# EasyEDA Pro project 3轴6.1--esp32 -(0604)改.eprj, schematic 原理图
Board Name: esp32; Create Date: 2025-05-14; Page Name: 电源; Project Name: 3轴6.1--esp32; Schematic Name: 原理图; Update Date: 2025-05-30; Company: 嘉立创EDA; Page Size: A3; Version: V1.0
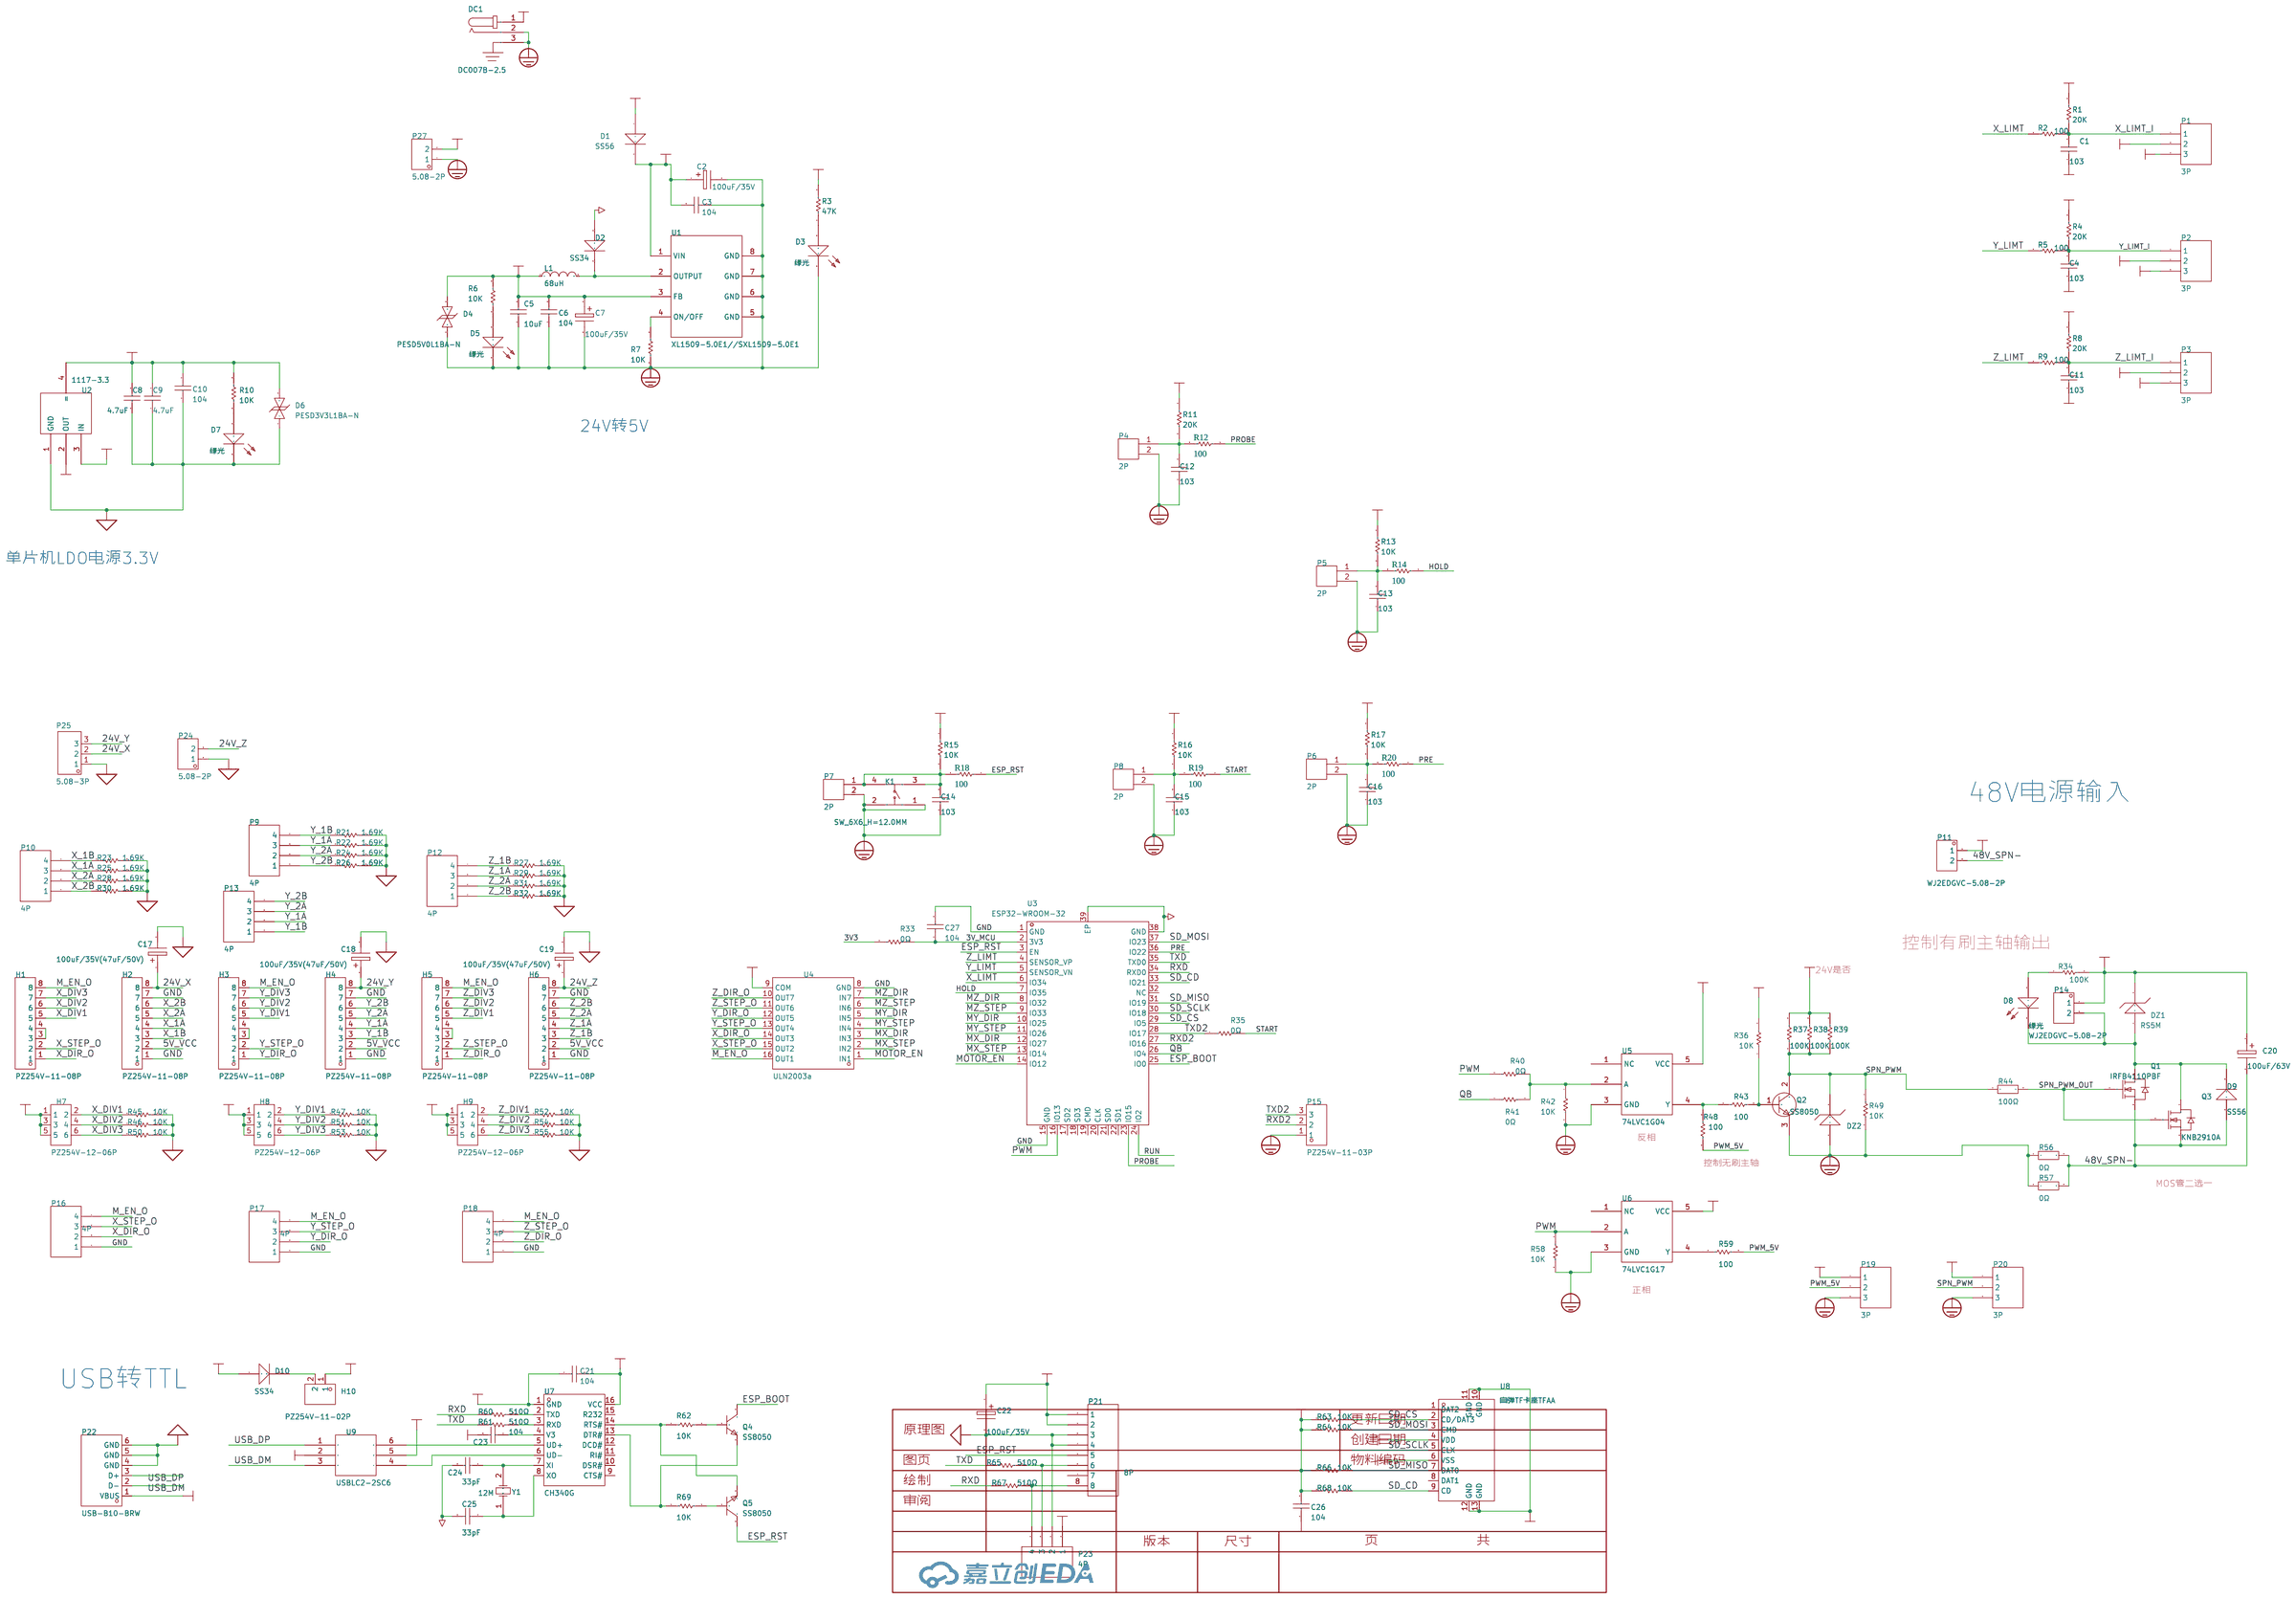
[diagram p0: schematic sheet]

## Parts
C1  103  [11]
C2  100uF/35V  [电解电容贴片6X6]
C3  104  [0603C]
C4  103  [11]
C5  10uF  [C1206]
C6  104  [0603C]
C7  100uF/35V  [电解电容贴片6X6]
C8  4.7uF  [C1206]
C9  4.7uF  [C1206]
C10  104  [0603C]
C11  103  [11]
C12  103  [11]
C13  103  [11]
C14  103  [11]
C15  103  [11]
C16  103  [11]
C17  100uF/35V(47uF/50V)  [电解电容贴片6X6]
C18  100uF/35V(47uF/50V)  [电解电容贴片6X6]
C19  100uF/35V(47uF/50V)  [电解电容贴片6X6]
C20  100uF/63V  [电解电容贴片10x10]
C21  104  [0603C]
C22  100uF/35V  [电解电容贴片6X6]
C23  104  [0603C]
C24  18pF  [0603C]
C25  18pF  [0603C]
C26  104  [11]
C27  104  [0603C]
D1  SS56  [SMA]
D2  SS34  [SMA]
D3  绿光  [0603LED]
D4  PESD5V0L1BA-N  [SOD-323_L1.8-W1.3-LS2.5-BI]
D5  绿光  [0603LED]
D6  PESD3V3L1BA-N  [SOD-323_L1.8-W1.3-LS2.5-BI]
D7  绿光  [0603LED]
D8  绿光  [0603LED]
D9  SS56  [SMA]
D10  SS34  [SMA]
DC1  DC007B-2.5  [DC-IN-TH_HX-DC007B-2.5]
DZ1  RS5M  [SMC]
DZ2  --ѹ------SMAZ10V  [SMA]
H1  PZ254V-11-08P  [HDR-TH_8P-P2.54-V-M]
H2  PZ254V-11-08P  [HDR-TH_8P-P2.54-V-M]
H3  PZ254V-11-08P  [HDR-TH_8P-P2.54-V-M]
H4  PZ254V-11-08P  [HDR-TH_8P-P2.54-V-M]
H5  PZ254V-11-08P  [HDR-TH_8P-P2.54-V-M]
H6  PZ254V-11-08P  [HDR-TH_8P-P2.54-V-M]
H7  PZ254V-12-06P  [HDR-TH_PZ254V-12-06P-A40]
H8  PZ254V-12-06P  [HDR-TH_PZ254V-12-06P-A40]
H9  PZ254V-12-06P  [HDR-TH_PZ254V-12-06P-A40]
H10  PZ254V-11-02P  [HDR-TH_2P-P2.54-V-M]
K1  SW_6X6_H=12.0MM  [KEY-SMD_4P-L6.0-W6.0-P4.50-LS9.0]
L1  68uH  [IND-SMD_L7.0-W7.0_SMDRI74-330MT]
P1  3P  [HDR1X3_CON]
P2  3P  [HDR1X3_CON]
P3  3P  [HDR1X3_CON]
P4  2P  [HDR1X2_CON]
P5  2P  [HDR1X2_CON]
P6  2P  [HDR1X2_CON]
P7  2P  [HDR1X2_CON]
P8  2P  [HDR1X2_CON]
P9  4P  [HDR1X4_CON]
P10  4P  [HDR1X4_CON]
P11  WJ2EDGVC-5.08-2P  [CONN-TH_WJ2EDGVC-5.08-2P]
P12  4P  [HDR1X4_CON]
P13  4P  [HDR1X4_CON]
P14  WJ2EDGVC-5.08-2P  [CONN-TH_WJ2EDGVC-5.08-2P]
P15  PZ254V-11-03P  [HDR-TH_3P-P2.54-V-M]
P16  4P  [SIP4]
P17  4P  [SIP4]
P18  4P  [SIP4]
P19  3P  [HDR1X3_CON]
P20  3P  [HDR1X3_CON]
P21  8P  [IDC8]
P22  USB-B10-BRW  [USB-B-TH_USB-B10-BRW]
P23  4P  [HDR1X4_CON]
P24  5.08-2P  [CONN-TH_WJ2EDGVC-5.08-2P]
P25  5.08-3P  [CONN-TH_3P-P5.08-WJ2EDGVC-3P]
P27  5.08-2P  [CONN-TH_WJ2EDGVC-5.08-2P]
Q1  IRFB4110PBF  [TO-220-3_L10.0-W4.5-P2.54-L]
Q2  SS8050  [SOT-23]
Q3  KNB2910A  [TO-263-2_L10.0-W9.1-P5.08-LS15.2-TL]
Q4  SS8050  [SOT-23-3_L2.9-W1.3-P1.90-LS2.4-BR]
Q5  SS8050  [SOT-23-3_L2.9-W1.3-P1.90-LS2.4-BR]
R1  20K  [10]
R2  100  [10]
R3  47K  [0603R]
R4  20K  [10]
R5  100  [10]
R6  10K  [0603R]
R7  10K  [0603R]
R8  20K  [10]
R9  100  [10]
R10  10K  [0603R]
R11  10K  [0603R]
R12  100  [0603R]
R13  10K  [0603R]
R14  100  [0603R]
R15  10K  [0603R]
R16  10K  [0603R]
R17  10K  [0603R]
R18  100  [0603R]
R19  100  [0603R]
R20  100  [0603R]
R21  10K  [0603R]
R22  10K  [0603R]
R23  10K  [0603R]
R24  10K  [0603R]
R25  10K  [0603R]
R26  10K  [0603R]
R27  10K  [0603R]
R28  10K  [0603R]
R29  10K  [0603R]
R30  10K  [0603R]
R31  10K  [0603R]
R32  10K  [0603R]
R33  0Ω  [0603R]
R34  100K  [0603R]
R35  0Ω  [0603R]
R36  10K  [0603R]
R37  100K  [0603R]
R38  100K  [0603R]
R39  100K  [0603R]
R40  0Ω  [0603R]
R41  0Ω  [0603R]
R42  10K  [0603R]
R43  100  [0603R]
R44  100Ω  [R0603]
R45  10K  [0603R]
R46  10K  [0603R]
R47  10K  [0603R]
R48  100  [0603R]
R49  10K  [0603R]
R50  10K  [0603R]
R51  10K  [0603R]
R52  10K  [0603R]
R53  10K  [0603R]
R54  10K  [0603R]
R55  10K  [0603R]
R56  0Ω  [R1210]
R57  0Ω  [R1210]
R58  10K  [0603R]
R59  100  [0603R]
R60  510Ω  [0603R]
R61  510Ω  [0603R]
R62  10K  [0603R]
R63  10K  [10]
R64  10K  [10]
R65  510Ω  [0603R]
R66  10K  [10]
R67  510Ω  [0603R]
R68  10K  [10]
R69  10K  [0603R]
U1  XL1509-5.0E1//SXL1509-5.0E1  [ESOP-8_L4.9-W3.9-P1.27-LS6.0-BL-EP]
U2  1117-3.3  [SOT-223]
U3  ESP32-WROOM-32  [WIFI-SMD_ESP32-WROOM-32UE-A]
U4  ULN2003a  [SOP-16_L9.9-W3.9-P1.27-LS6.0-BL]
U5  74LVC1G04  [SOT-23-5]
U6  74LVC1G17  [SOT-23-5]
U7  CH340G  [SOIC-16_L9.9-W3.9-P1.27-LS6.0-BL]
U8  自弹TF卡座TFAA  [SIM-SMD_C9900015645]
U9  USBLC2-2SC6  [SOT-23-6]
Y1  12M  [晶振贴片49SSMD]

## Library data of the parts
C1 C4 C11-C16 = 103: Design Item ID: CAP; Library Name: SCH封装库
C2 C7 C17-C19 C22 = 100uF/35V: Origin Footprint 2: X47U; Origin Footprint 1: 电解电容贴片6x6; Design Item ID: ELECTRO1; Library Name: *
C3 C6 C10 C27 = 104: Capacitor (Semiconductor SIM Model); Published: 8-Jun-2000; LatestRevisionDate: 17-Jul-2002; LatestRevisionNote: Re-released for DXP Platform.; PackageReference: C1206; Publisher: Altium Limited; Origin Footprint 2: C1206; Origin Footprint 3: 0402; Origin Footprint 4: 1310[0504]; Origin Footprint 5: 1608[0603]; Origin Footprint 6: C1210; Origin Footprint 7: C0805; Origin Footprint 8: C1206; Origin Footprint 9: 0805; Origin Footprint 10: 0805L; Design Item ID: Cap Semi; Library Name: Miscellaneous Devices
C5 C8 C9 = 104: Design Item ID: CAP; Library Name: SCH--װ--
C20 = 100uF/63V: Origin Footprint 2: X47U; Design Item ID: ELECTRO1; Library Name: *
C21 = 103: Capacitor (Semiconductor SIM Model); Published: 8-Jun-2000; LatestRevisionDate: 17-Jul-2002; LatestRevisionNote: Re-released for DXP Platform.; PackageReference: C1206; Publisher: Altium Limited; Origin Footprint 2: C1206; Origin Footprint 3: 0402; Origin Footprint 4: 1310[0504]; Origin Footprint 5: 1608[0603]; Origin Footprint 6: C1210; Origin Footprint 7: C0805; Origin Footprint 8: C1206; Origin Footprint 9: 0805; Origin Footprint 10: 0805L; Design Item ID: Cap Semi; Library Name: Miscellaneous Devices
C23 = 104: Capacitor (Semiconductor SIM Model); Published: 8-Jun-2000; LatestRevisionDate: 17-Jul-2002; LatestRevisionNote: Re-released for DXP Platform.; PackageReference: C1206; Publisher: Altium Limited; Origin Footprint 2: C1206; Origin Footprint 3: 0402; Origin Footprint 4: 1310[0504]; Origin Footprint 5: 1608[0603]; Origin Footprint 6: C1210; Origin Footprint 7: C0805; Origin Footprint 8: C1206; Origin Footprint 9: 0805; Origin Footprint 10: 0805L; Origin Footprint 11: 0805C; Design Item ID: Cap Semi; Library Name: Miscellaneous Devices
C24 C25 = 33pF: Capacitor (Semiconductor SIM Model); Published: 8-Jun-2000; LatestRevisionDate: 17-Jul-2002; LatestRevisionNote: Re-released for DXP Platform.; PackageReference: C1206; Publisher: Altium Limited; Origin Footprint 2: C1206; Origin Footprint 3: 0402; Origin Footprint 4: 1310[0504]; Origin Footprint 5: 1608[0603]; Origin Footprint 6: C1210; Origin Footprint 7: C0805; Origin Footprint 8: C1206; Origin Footprint 9: 0805; Origin Footprint 10: 0805L; Design Item ID: Cap Semi; Library Name: Miscellaneous Devices
C26 = 104: Capacitor (Semiconductor SIM Model); Published: 8-Jun-2000; LatestRevisionDate: 17-Jul-2002; LatestRevisionNote: Re-released for DXP Platform.; PackageReference: C1206; Publisher: Altium Limited; Origin Footprint 2: C1206; Origin Footprint 3: 0402; Origin Footprint 4: 1310[0504]; Origin Footprint 5: 1608[0603]; Origin Footprint 6: C1210; Origin Footprint 7: C0805; Origin Footprint 8: C1206; Origin Footprint 9: 0805; Origin Footprint 10: 0805L; Origin Footprint 11: 0805C; Origin Footprint 1: 0603C; Design Item ID: Cap Semi; Library Name: Miscellaneous Devices
D1 D10 = SS56: Design Item ID: 1N4148; Library Name: SCH封装库
D2 D9 = SS56: Design Item ID: 1N4148; Library Name: SCH--װ--
D3 D5 D7 D8 = 绿光: Origin Footprint 2: LED(小); Design Item ID: LED; Library Name: SCH封装库
D4 D6 = PESD5V0S1BBN: 极性:Bidirectional;反向关断电压（典型值）:5V (Max);击穿电压（最小值）:6V;箝位电压:15V;峰值脉冲电流（10/1000us）:5A (8/20us);; Supplier Part: C314264; Manufacturer: BORN伯恩半导体; Supplier Footprint: SOD-523; JLCPCB Part Class: Extended Part; Datasheet: https://atta.szlcsc.com/upload/public/pdf/source/20181015/C314264_F9AC5761AC2631DA841FBD1D9C6821E3.pdf; Supplier: LCSC; Polarity: Bidirectional; Voltage - Reverse Standoff (Typ): 5V (Max); Voltage - Breakdown (Min): 6V; Voltage - Clamping (Max) @ Ipp: 15V; Current - Peak Pulse (10/1000μs): 5A (8/20us)
DC1 = DC007B-2.5: 连接器类型:DC电源插座;安装方式:弯插;触点内径:2.5mm;触点外径:7.7mm;额定电流:5A;额定电压:20V;工作温度:-25℃~+70℃;; LCSC Part Name: DC电源插座 内径:2.5mm 外径:7.7mm; Supplier Part: C17701685; Manufacturer: SHOU HAN(首韩); Supplier Footprint: 插件; JLCPCB Part Class: 扩展库; Datasheet: https://atta.szlcsc.com/upload/public/pdf/source/20230912/B85EC3863CDA4EDD9FBFF38F4F2C356A.pdf; Supplier: LCSC; Connector Type: DC电源插座; Mounting Type: 弯插; Inside Contact Diameter: 2.5mm; Outside Contact Diameter: 7.7mm; Current Rating: 5A; Voltage Rating (Max): 20V; Operating Temperature: -25℃~+70℃
DZ1 = ��ָ�������RS2M: Design Item ID: --ѹ------; Library Name: SCH--װ--
DZ2 = ��ѹ������SMAZ10V: Design Item ID: --ѹ------; Library Name: SCH--װ--
H1-H6 = PZ254V-11-08P: LCSC Part Name: 间距:2.54mm 1x8P 直插 方针; Supplier Part: C492407; Manufacturer: XFCN(兴飞); Supplier Footprint: 插件,P=2.54mm; JLCPCB Part Class: 扩展库; Datasheet: https://atta.szlcsc.com/upload/public/pdf/source/20200309/C492407_83A6FB26A2233368EDB9516968EC6149.pdf; Supplier: LCSC; Pin Structure: 1x8P; Pitch: 2.54mm; Circluar Pins/Square Pins: 方针; Mounting Type: 直插; Number of Rows: 单排; Number of Pins: 8P; Length of Mating Pin: 6mm; Insulation Height: 2.5mm; Length of End Connection Pin: 3mm; Contact Material: 黄铜; Operating Temperature Range: -40℃~+105℃; Color: 黑色
H7-H9 = PZ254V-12-06P-A40: LCSC Part Name: 排针2.54mm间距 直插 2x03位 直针外露4mm; Supplier Part: C45384661; Manufacturer: XFCN(兴飞); Supplier Footprint: 插件,P=2.54mm; Datasheet: https://atta.szlcsc.com/upload/public/pdf/source/20250224/DF63EC05642BAFA253D2300DF133B397.pdf; Supplier: LCSC
H10 = PZ254V-11-02P: 插针结构:1x2P;间距:2.54mm;行距:-;圆针/方针:方针;安装类型:直插;排数:单排;总PIN位数:2P;额定电流:-;额定电压:-;配合针长度:6mm;塑高:2.5mm;端接针长度:3mm;触头材质:黄铜;触头镀层:-;工作温度范围:-40℃~+105℃;颜色:黑色;; LCSC Part Name: 间距:2.54mm 1x2P 直插 方针; Supplier Part: C492401; Manufacturer: XFCN(兴飞); Supplier Footprint: 插件,P=2.54mm; JLCPCB Part Class: 扩展库; Datasheet: https://atta.szlcsc.com/upload/public/pdf/source/20200309/C492401_A812433581A9B211A7FFA413ADDFF0E5.pdf; Supplier: LCSC; Pin Structure: 1x2P; Pitch: 2.54mm; Circluar Pins/Square Pins: 方针; Mounting Type: 直插; Number of Rows: 单排; Number of Pins: 2P; Length of Mating Pin: 6mm; Insulation Height: 2.5mm; Length of End Connection Pin: 3mm; Contact Material: 黄铜; Operating Temperature Range: -40℃~+105℃; Color: 黑色
K1 = SW_6X6_H=12.0MM: Supplier Part: C9900018802; Supplier Footprint: KEY-SMD; JLCPCB Part Class: 扩展库; Supplier: LCSC
L1 = SMDRI74-330MT: 电感值:33uH;精度:±20%;额定电流:960mA;饱和电流(Isat):1.8A;类型:屏蔽电感;; LCSC Part Name: 33uH±20%1.8A; Supplier Part: C49625; Manufacturer: SXN(顺翔诺); Supplier Footprint: SMD,7.5x7.5mm; JLCPCB Part Class: 扩展库; Datasheet: https://atta.szlcsc.com/upload/public/pdf/source/20210810/6F96FDC19AA308DD2AD166FFB9640E87.pdf; Supplier: LCSC; Tolerance: ±20%; Rated Current: 960mA; Saturation Current (Isat): 1.8A; DC Resistance (DCR): 170mΩ; Type: 屏蔽电感
P1-P3 P19 P20 = 3P: Library Name: SCH封装库
P4-P8 = 2P: Library Name: SCH--װ--
P9 P10 P12 P13 P23 = 4P: Library Name: SCH封装库
P11 P14 P24 P27 = WJ2EDGVC-5.08-2P: LCSC Part Name: 1x2P 5.08mm 排数:1 每排P数:2; Supplier Part: C8445; Manufacturer: KANGNEX(康奈克斯电气); Supplier Footprint: 插件,P=5.08mm; JLCPCB Part Class: 扩展库; Datasheet: https://atta.szlcsc.com/upload/public/pdf/source/20191225/C8445_EB1D2D396D429FBA4C627FE17CC77AF0.pdf; Supplier: LCSC; Connector Type: 板端/插座-闭口; Structure: 1x2P; Pitch: 5.08mm; Color: 绿色; Mounting Style: 直针; Number of Pins: 2P; Number of Rows: 1; Number of PINs Per Row: 2; Current Rating (Max): 20A; Voltage Rating (Max): 450V; Contact Material: 黄铜; Contact Plating: 锡; Operating Temperature Range: -40℃~+105℃
P15 = PZ254V-11-03P: 插针结构:1x3P;间距:2.54mm;行距:-;圆针/方针:方针;安装类型:直插;排数:单排;总PIN位数:3P;额定电流:3A;额定电压:250V;配合针长度:6mm;塑高:2.5mm;端接针长度:3mm;工作温度范围:-40℃~+105℃;颜色:黑色;; LCSC Part Name: 间距:2.54mm 1x3P 直插 方针; Supplier Part: C2937625; Manufacturer: XFCN(兴飞); Supplier Footprint: 插件,P=2.54mm; JLCPCB Part Class: 扩展库; Datasheet: https://atta.szlcsc.com/upload/public/pdf/source/20200309/C492402_8335C3D49C4E4C618838D59BB1D024C1.pdf; Supplier: LCSC; Pin Structure: 1x3P; Pitch: 2.54mm; Circluar Pins/Square Pins: 方针; Mounting Type: 直插; Number of Rows: 单排; Number of Pins: 3P; Current Rating (Max): 3A; Voltage Rating (Max): 250V; Length of Mating Pin: 6mm; Insulation Height: 2.5mm; Length of End Connection Pin: 3mm; Operating Temperature Range: -40℃~+105℃; Color: 黑色
P16-P18 = 4P: Library Name: SCH--װ--
P21 = 8P: Library Name: SCH封装库
P22 = USB-B10-BRW: 连接器类型:Type-B;标准:USB 2.0;公母:母;端口数量:1;触点数量:4P;安装方式:弯插;额定电流 - 电源:1.5A;工作温度范围:-20℃~+70℃;焊接温度(最大值):260℃;; LCSC Part Name: Type-B母弯插; Supplier Part: C720549; Manufacturer: XUNPU(讯普); Supplier Footprint: 插件; JLCPCB Part Class: 扩展库; Datasheet: https://atta.szlcsc.com/upload/public/pdf/source/20200812/C720549_53E9294752E2933874870440E626C579.pdf; Supplier: LCSC; Connector Type: Type-B; Standard: USB2.0; Gender: 母; Number of Ports: 1; Number of Contacts: 4P; Mounting Style: 弯插; Current Rating - Power (Max): 1.5A; Operating Temperature Range: -20℃~+70℃; Soldering Temperature(Max): 260℃
P25 = WJ2EDGVC-5.08-3P: LCSC Part Name: 5.08mm 排数:1 每排P数:3 直针; Supplier Part: C8412; Manufacturer: KANGNEX(康奈克斯电气); Supplier Footprint: P=5.08mm; JLCPCB Part Class: Extended Part; Datasheet: https://atta.szlcsc.com/upload/public/pdf/source/20191225/C8412_23807AE80A579B589D5B1121BF572DD0.pdf; Supplier: LCSC; Connector Type: 板端/插座-闭口; Pitch: 5.08mm; Number of Rows: 1; Number of PINs Per Row: 3; Mounting Style: 直针; Color: 绿色
Q1 = IRFB4110PBF: 类型:1个N沟道;漏源电压(Vdss):100V;连续漏极电流(Id):180A;导通电阻(RDS(on)@Vgs,Id):4.5mΩ@10V,75A;功率(Pd):370W;阈值电压(Vgs(th)@Id):4V@250uA;; LCSC Part Name: 1个N沟道 耐压:100V 电流:180A; Supplier Part: C2650; Manufacturer: Infineon(英飞凌); Supplier Footprint: TO-220; JLCPCB Part Class: 扩展库; Datasheet: https://atta.szlcsc.com/upload/public/pdf/source/20140820/1457707230776.pdf; Supplier: LCSC; Type: 1个N沟道; Drain Source Voltage (Vdss): 100V; Continuous Drain Current (Id): 180A; Drain Source On Resistance (RDS(on)@Vgs,Id): 4.5mΩ@10V,75A; Power Dissipation (Pd): 370W; Gate Threshold Voltage (Vgs(th)@Id): 4V@250uA; Total Gate Charge (Qg@Vgs): 210nC; Input Capacitance (Ciss@Vds): 9.62nF; Reverse Transfer Capacitance (Crss@Vds): 250pF; Operating Temperature: -55℃~+175℃
Q2 = SS8050: Published: 8-Jun-2000; LatestRevisionDate: 17-Jul-2002; LatestRevisionNote: Re-released for DXP Platform.; PackageReference: TO-226; Publisher: Altium Limited; Code_JEDEC: TO-226-AA; Origin Footprint 2: TO-92; Design Item ID: NPN; Library Name: SCH--װ--
Q3 = KNB2910A: LCSC Part Name: 1个N沟道 耐压:100V 电流:130A; Supplier Part: C176890; Manufacturer: KIA; Supplier Footprint: TO-263-2; JLCPCB Part Class: 扩展库; Datasheet: https://atta.szlcsc.com/upload/public/pdf/source/20180125/C176890_15168702140711304865.pdf; Supplier: LCSC; Drain to Source Voltage: 100V; Current - Continuous Drain(Id): 130A; RDS(on): 9mΩ@70V,10A; Pd - Power Dissipation: 300W; Gate Threshold Voltage (Vgs(th)@Id): 4V
Q4 Q5 = SS8050: LCSC Part Name: NPN 25V 1.5A 120-400 SOT-23; Supplier Part: C2931717; Manufacturer: Doeshare(德芯); Supplier Footprint: SOT-23; JLCPCB Part Class: 扩展库; Datasheet: https://atta.szlcsc.com/upload/public/pdf/source/20220106/99F9A3DFCBDD91265C711555CE6390BF.pdf; Supplier: LCSC
R1 R4 R8 R63 R64 R66 R68 = 10K: Resistor; Published: 8-Jun-2000; LatestRevisionDate: 17-Jul-2002; LatestRevisionNote: Re-released for DXP Platform.; PackageReference: AXIAL-0.3; Publisher: Altium Limited; Origin Footprint 2: AXIAL-0.3; Origin Footprint 3: R0805; Origin Footprint 4: 0805R; Origin Footprint 1: 0603R; Design Item ID: RES; Library Name: SCH封装库
R2 R5 R9 = 100: Resistor; Published: 8-Jun-2000; LatestRevisionDate: 17-Jul-2002; LatestRevisionNote: Re-released for DXP Platform.; PackageReference: AXIAL-0.3; Publisher: Altium Limited; Origin Footprint 2: AXIAL-0.3; Origin Footprint 3: R0805; Origin Footprint 4: 0805R; Origin Footprint 1: 0603R; Design Item ID: RES; Library Name: SCH封装库
R3 = 1K: Resistor; Published: 8-Jun-2000; LatestRevisionDate: 17-Jul-2002; LatestRevisionNote: Re-released for DXP Platform.; PackageReference: AXIAL-0.3; Publisher: Altium Limited; Origin Footprint 2: AXIAL-0.3; Origin Footprint 3: R0805; Origin Footprint 4: 0805R; Design Item ID: RES; Library Name: SCH封装库
R6 R10 R11 R13 R15-R17 R62 R69 = 10K: Resistor; Published: 8-Jun-2000; LatestRevisionDate: 17-Jul-2002; LatestRevisionNote: Re-released for DXP Platform.; PackageReference: AXIAL-0.3; Publisher: Altium Limited; Origin Footprint 2: AXIAL-0.3; Origin Footprint 3: R0805; Origin Footprint 4: 0805R; Design Item ID: RES; Library Name: SCH封装库
R7 = 10k: Resistor; Published: 8-Jun-2000; LatestRevisionDate: 17-Jul-2002; LatestRevisionNote: Re-released for DXP Platform.; PackageReference: AXIAL-0.3; Publisher: Altium Limited; Origin Footprint 2: AXIAL-0.3; Origin Footprint 3: R0805; Origin Footprint 4: 0805R; Design Item ID: RES; Library Name: SCH封装库
R12 R14 R18-R20 R33 R35 R40 R41 R43 R48 R59 = 100: Resistor; Published: 8-Jun-2000; LatestRevisionDate: 17-Jul-2002; LatestRevisionNote: Re-released for DXP Platform.; PackageReference: AXIAL-0.3; Publisher: Altium Limited; Origin Footprint 2: AXIAL-0.3; Origin Footprint 3: R0805; Origin Footprint 4: 0805R; Design Item ID: RES; Library Name: SCH--װ--
R21-R32 R34 R36 R42 R45-R47 R49-R55 R58 = 10K: Resistor; Published: 8-Jun-2000; LatestRevisionDate: 17-Jul-2002; LatestRevisionNote: Re-released for DXP Platform.; PackageReference: AXIAL-0.3; Publisher: Altium Limited; Origin Footprint 2: AXIAL-0.3; Origin Footprint 3: R0805; Origin Footprint 4: 0805R; Design Item ID: RES; Library Name: SCH--װ--
R37-R39 = 1K: Resistor; Published: 8-Jun-2000; LatestRevisionDate: 17-Jul-2002; LatestRevisionNote: Re-released for DXP Platform.; PackageReference: AXIAL-0.3; Publisher: Altium Limited; Origin Footprint 2: AXIAL-0.3; Origin Footprint 3: R0805; Origin Footprint 4: 0805R; Design Item ID: RES; Library Name: SCH--װ--
R44 = Res_0603: Supplier Footprint: 0603
R56 R57 = Res_1210: Supplier Footprint: 1210
R60 R61 R65 R67 = 100: Resistor; Published: 8-Jun-2000; LatestRevisionDate: 17-Jul-2002; LatestRevisionNote: Re-released for DXP Platform.; PackageReference: AXIAL-0.3; Publisher: Altium Limited; Origin Footprint 2: AXIAL-0.3; Origin Footprint 3: R0805; Origin Footprint 4: 0805R; Design Item ID: RES; Library Name: SCH封装库
U1 = XL1509-5.0E1: 功能类型:降压型;同步整流:-;输出通道数:-;拓扑结构:-;输入电压:-;输出电流(最大值):-;开关频率:-;; LCSC Part Name: 降压型; Supplier Part: C61063; Manufacturer: XLSEMI(芯龙); Supplier Footprint: SOP-8_150mil; JLCPCB Part Class: Basic Part; Datasheet: https://atta.szlcsc.com/upload/public/pdf/source/20151020/1457707483545.pdf; Supplier: LCSC; Function: 降压型
U2 = 1117-3.3: Design Item ID: LM1117; Library Name: Party600
U3 = ESP32-WROOM-32: Supplier Part: C95209; Manufacturer: ESPRESSIF(乐鑫); JLCPCB Part Class: 扩展库; Datasheet: https://atta.szlcsc.com/upload/public/pdf/source/20170925/C95209_1506321763821990573.pdf; Supplier: LCSC
U4 = ULN2003_C18164408: 通道数:七路;集射击穿电压(Vceo):50V;集电极电流(Ic):500mA;; LCSC Part Name: ULN2003; Supplier Part: C18164408; Manufacturer: GR(国睿); Supplier Footprint: SOP-16; JLCPCB Part Class: 扩展库; Datasheet: https://atta.szlcsc.com/upload/public/pdf/source/20230915/31D6968A1DB9572D6F2E183AA116B56A.pdf; Supplier: LCSC; number of channels: 七路; Maximum collector Emitter Voltage (Vceo): 50V; Collector Current(Ic): 500mA; maximum input voltage: 30V; Operating Temperature: -40℃~+85℃
U5 = 74LVC1G04: Design Item ID: 74LVC1G17; Library Name: SCH--װ--
U6 = 74LVC1G04: Library Name: SCH--װ--
U7 = CH340G: 应用功能:收发器;接口协议:USB 2.0;数据速率:2Mbps;; LCSC Part Name: USB转串口芯片 CH340; Supplier Part: C14267; Manufacturer: WCH(南京沁恒); Supplier Footprint: SOP-16; JLCPCB Part Class: 扩展库; Datasheet: https://atta.szlcsc.com/upload/public/pdf/source/20230530/6E401E9554E9F5311886CC8B3F89B62E.pdf; Supplier: LCSC; Applications Function: 收发器; Protocol: USB 2.0; Supply Voltage: 3.3V；5V; Data Rate: 2Mbps
U8 = 自弹TF卡座TFAA: Supplier Part: C9900015645; Supplier Footprint: SMD; JLCPCB Part Class: 扩展库; Supplier: LCSC
U9 = USBLC2-2SC6: Design Item ID: DIP6; Library Name: SCH封装库
Y1 = 12M: Crystal Oscillator; Published: 8-Jun-2000; LatestRevisionDate: 17-Jul-2002; LatestRevisionNote: Re-released for DXP Platform.; PackageReference: R38; Publisher: Altium Limited; Origin Footprint 2: R38; Origin Footprint 3: XTAL-49S; Design Item ID: XTAL; Library Name: Miscellaneous Devices

## Nets
3V3: C8.2 C9.2 C10.2 C26.2 D6.2 R10.2 R13.1 R15.1 R33.1 R63.2 R64.2 R66.2 R68.2 U2.2(OUT) U2.4(=) U8.4(VDD)
3V_MCU: C27.1 R16.1 R17.1 R33.2 U3.2(3V3)
5V_VCC: C5.1 C6.2 C7.1 C21.1 C22.1 D4.2 H2.2 H4.2 H6.2 H7.1 H7.3 H7.5 H8.1 H8.3 H8.5 H9.1 H9.3 H9.5 H10.1 L1.1 P1.3 P2.3 P3.3 P19.1 P20.1 P21.1 P21.2 P23.1 R1.2 R4.2 R6.2 R8.2 R11.1 R36.2 U1.3(FB) U2.3(IN) U4.9(COM) U5.5(VCC) U6.5(VCC) U7.16(VCC)
24V: D1.1 DC1.1 P27.2 R3.2 R37.2 R38.2 R39.2
24V_X: C17.1 H2.8 P25.2
24V_Y: C18.1 H4.8 P25.3
24V_Z: C19.1 H6.8 P24.2
48V_SPN+: C20.1 DZ1.2 P11.1 P14.1 R34.2
48V_SPN-: C20.2 D9.1 P11.2 Q1.3(S) Q3.3(S) R56.2 R57.2
GND: C1.1 C2.2 C3.1 C4.1 C5.2 C6.1 C7.2 C8.1 C9.1 C10.1 C11.1 C12.1 C13.1 C14.1 C15.1 C16.1 C17.2 C18.2 C19.2 C21.2 C22.2 C23.2 C24.2 C25.2 C26.1 C27.2 D2.1 D3.2 D4.1 D5.2 D6.1 D7.2 DC1.2 DC1.3 DZ2.1 H2.1 H2.7 H4.1 H4.7 H6.1 H6.7 K1.1 K1.2 P1.2 P2.2 P3.2 P4.2 P5.2 P6.2 P7.2 P8.2 P15.1 P16.1 P17.1 P18.1 P19.3 P20.3 P21.3 P21.4 P22.4(GND) P22.5(GND) P22.6(GND) P23.2 P24.1 P25.1 P27.1 Q2.3(E) R7.2 R21.2 R22.2 R23.2 R24.2 R25.2 R26.2 R27.2 R28.2 R29.2 R30.2 R31.2 R32.2 R42.2 R45.2 R46.2 R47.2 R49.2 R50.2 R51.2 R52.2 R53.2 R54.2 R55.2 R56.1 R57.1 R58.2 U1.5(GND) U1.6(GND) U1.7(GND) U1.8(GND) U2.1(GND) U3.1(GND) U3.15(GND) U3.38(GND) U3.39(EP) U4.8(GND) U5.3(GND) U6.3(GND) U7.1(GND) U8.6(VSS) U8.10(GND) U8.11(GND) U8.12(GND) U8.13(GND) U9.2
VIN_24V: C2.1 C3.2 D1.2 U1.1(VIN)
ESP_BOOT: Q4.3(C) U3.25(IO0)
ESP_RST: P21.5 Q5.3(C) R18.1 U3.3(EN)
HOLD: R14.1 U3.7(IO35)
M_EN_O: H1.8 H3.8 H5.8 P16.4 P17.4 P18.4 U4.16(OUT1)
MOTOR_EN: U3.14(IO12) U4.1(IN1)
MX_DIR: U3.12(IO27) U4.3(IN3)
MX_STEP: U3.13(IO14) U4.2(IN2)
MY_DIR: U3.10(IO25) U4.5(IN5)
MY_STEP: U3.11(IO26) U4.4(IN4)
MZ_DIR: U3.8(IO32) U4.7(IN7)
MZ_STEP: U3.9(IO33) U4.6(IN6)
PRE: R20.1 U3.36(IO22)
PROBE: R12.1 U3.23(IO15)
PWM: R40.1 R58.1 U3.16(IO13) U6.2(A)
PWM_5V: P19.2 R48.1 R59.2
QB: R41.1 U3.26(IO4)
RUN: U3.24(IO2)
RXD: R60.2 R67.1 U3.34(RXD0)
RXD2: P15.2 U3.27(IO16)
SD_CD: R68.1 U3.33(IO21) U8.9(CD)
SD_CS: R63.1 U3.29(IO5) U8.2(CD/DAT3)
SD_MISO: R66.1 U3.31(IO19) U8.7(DAT0)
SD_MOSI: R64.1 U3.37(IO23) U8.3(CMD)
SD_SCLK: U3.30(IO18) U8.5(CLX)
SPN_PWM: DZ2.2 P20.2 Q2.2(C) R37.1 R38.1 R39.1 R44.1 R49.1
SPN_PWM_OUT: Q1.1(G) Q3.1(G) R44.2
START: R19.1 R35.2
TXD: R61.2 R65.1 U3.35(TXD0)
TXD2: P15.3 R35.1 U3.28(IO17)
USB_DM: P22.2(D-) U9.3
USB_DP: P22.3(D+) U9.1
VUSB: D10.1 P22.1(VBUS) U9.5
X_1A: H2.4 P10.3 R25.1
X_1B: H2.3 P10.4 R23.1
X_2A: H2.5 P10.2 R28.1
X_2B: H2.6 P10.1 R30.1
X_DIR_O: H1.1 P16.2 U4.14(OUT3)
X_DIV1: H1.5 H7.2 R45.1
X_DIV2: H1.6 H7.4 R46.1
X_DIV3: H1.7 H7.6 R50.1
X_LIMT: R2.2 U3.6(IO34)
X_LIMT_I: C1.2 P1.1 R1.1 R2.1
X_STEP_O: H1.2 P16.3 U4.15(OUT2)
Y_1A: H4.4 P9.3 P13.2 R22.1
Y_1B: H4.3 P9.4 P13.1 R21.1
Y_2A: H4.5 P9.2 P13.3 R24.1
Y_2B: H4.6 P9.1 P13.4 R26.1
Y_DIR_O: H3.1 P17.2 U4.12(OUT5)
Y_DIV1: H3.5 H8.2 R47.1
Y_DIV2: H3.6 H8.4 R51.1
Y_DIV3: H3.7 H8.6 R53.1
Y_LIMT: R5.2 U3.5(SENSOR_VN)
Y_LIMT_I: C4.2 P2.1 R4.1 R5.1
Y_STEP_O: H3.2 P17.3 U4.13(OUT4)
Z_1A: H6.4 P12.3 R29.1
Z_1B: H6.3 P12.4 R27.1
Z_2A: H6.5 P12.2 R31.1
Z_2B: H6.6 P12.1 R32.1
Z_DIR_O: H5.1 P18.2 U4.10(OUT7)
Z_DIV1: H5.5 H9.2 R52.1
Z_DIV2: H5.6 H9.4 R54.1
Z_DIV3: H5.7 H9.6 R55.1
Z_LIMT: R9.2 U3.4(SENSOR_VP)
Z_LIMT_I: C11.2 P3.1 R8.1 R9.1
Z_STEP_O: H5.2 P18.3 U4.11(OUT6)
$9N72390: D2.2 L1.2 U1.2(OUTPUT)
$9N72392: R7.1 U1.4(ON/OFF)
$9N72730: D3.1 R3.1
$9N85928: C23.1 U7.4(V3)
$9N85949: U7.5(UD+) U9.6
$9N85958: U7.6(UD-) U9.4
$9N85962: C24.1 U7.7(XI) Y1.2(OSC2)
$9N85965: C25.1 U7.8(XO) Y1.1(OSC1)
$9N85990: D10.2 H10.2
$9N86544: R60.1 U7.2(TXD)
$9N86546: R61.1 U7.3(RXD)
$9N86982: Q4.2(E) R69.1 U7.13(DTR#)
$9N86987: Q5.2(E) R62.1 U7.14(RTS#)
$9N87254: P21.6 P23.3 R65.2
$9N87257: P21.8 P23.4 R67.2
$9N88961: R59.1 U6.4(Y)
$9N89334: Q4.1(B) R62.2
$9N89338: Q5.1(B) R69.2
$9N90234: H1.3 H1.4
$9N91167: H3.3 H3.4
$9N91379: H5.3 H5.4
$9N98710: C14.2 K1.3 K1.4 P7.1 R15.2 R18.2
$9N100309: C15.2 P8.1 R16.2 R19.2
$9N100484: C12.2 P4.1 R11.2 R12.2
$9N100628: C16.2 P6.1 R17.2 R20.2
$9N100772: C13.2 P5.1 R13.2 R14.2
$9N100840: D7.1 R10.1
$9N100955: D5.1 R6.1
Net-(D8-1): D8.1 R34.1
Net-(D8-2): D8.2 D9.2 DZ1.1 P14.2 Q1.2(D) Q3.4(D)
Net-(Q2-1): Q2.1(B) R36.1 R43.2
Net-(R40-2): R40.2 R41.2 R42.1 U5.2(A)
Net-(R43-1): R43.1 R48.2 U5.4(Y)

Not connected (* = marked no-connect by the designer): P21 7; U3 17(SD2) 18(SD3) 19(CMD) 20(CLK) 21(SD0) 22(SD1) 32(NC); U5 1(NC); U6 1(NC); U7 9(CTS#) 10(DSR#) 11(RI#) 12(DCD#) 15(R232); U8 1(DAT2) 8(DAT1)

## Notes on the sheet
- 24V转5V
- 单片机LDO电源3.3V
- 48V电源输入
- 控制有刷主轴输出
- 24V是否
- 反相
- 控制无刷主轴
- MOS管二选一
- 正相
- USB转TTL
